# Altium schematic sheet 3. Buck Boost_19V.SchDoc
size A4; SheetNumber: 3; SheetTotal: 6; PageSetup: Record=PageOptions|CenterHorizontal=True|CenterVertical=True|PrintScale=1.00|XCorrection=1.00|YCorrection=1.00|PrintKind=0|BorderSize=5000000|LeftOffset=0|BottomOffset=0|Orientation=2|PaperLength=2970|PaperWidth=2100|Scale=100|PaperSource=7|PrintQuality=-3|MediaType=1|DitherType=10|PrintScaleMode=1|PaperKind=A4|PaperIndex=9
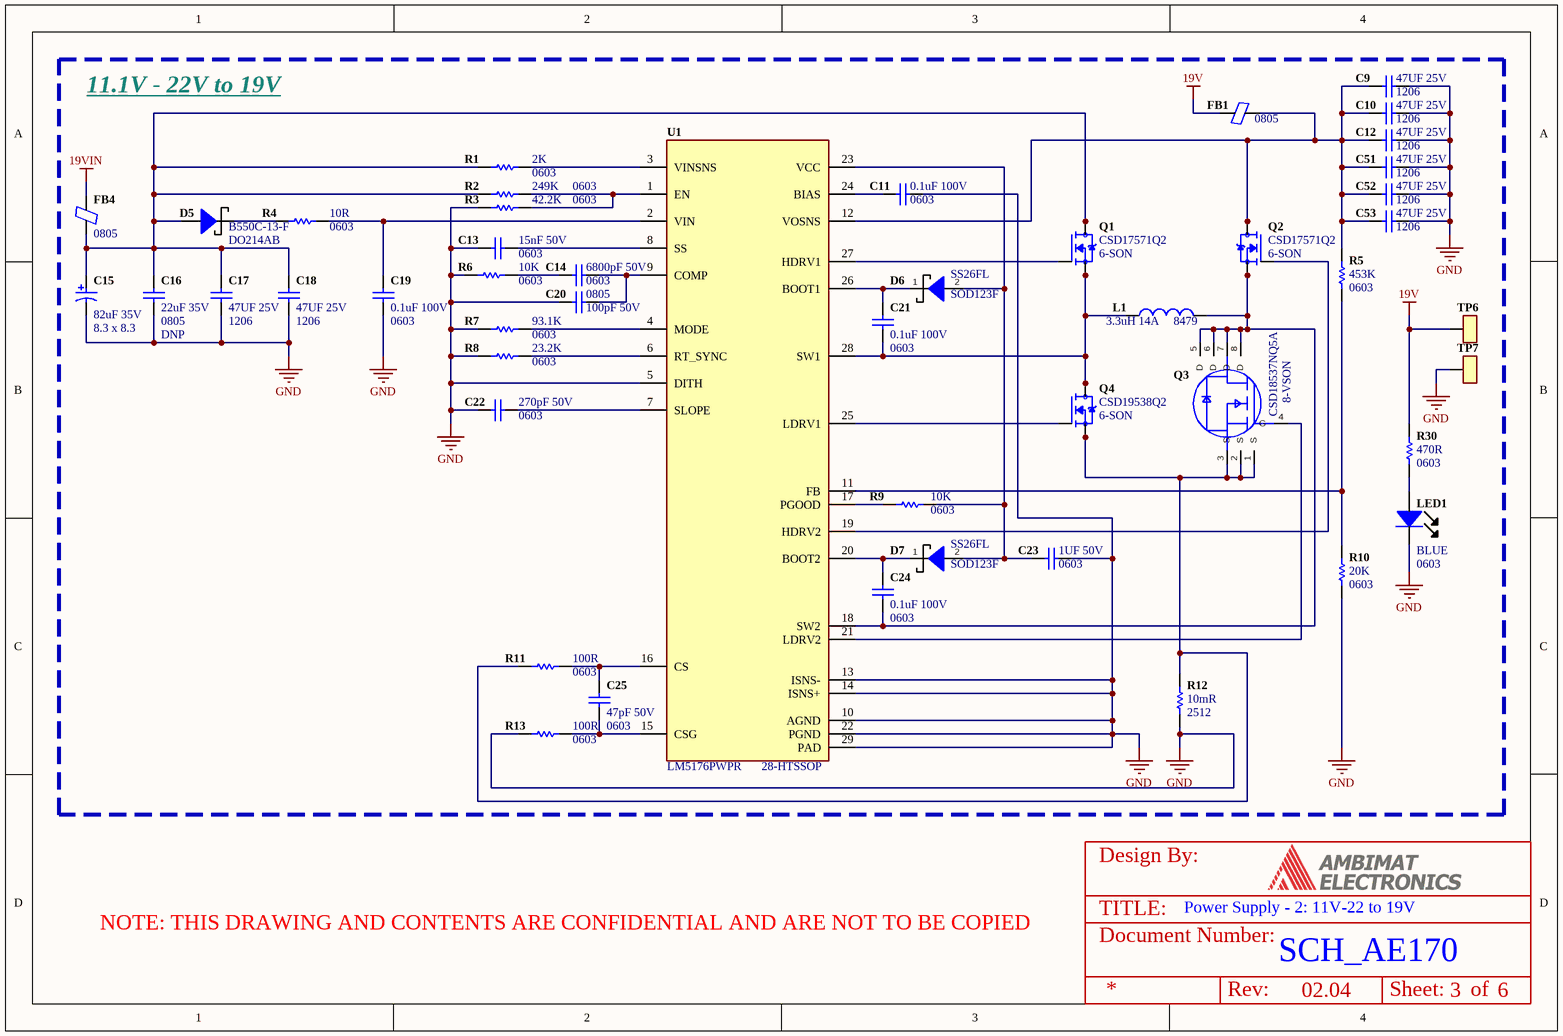
[diagram p0: 3. Buck Boost_19V.SchDoc]

## Parts
C9  Part Name: 47UF 25V  PCB Footprint: 1206  [1206 - NP]  (hidden comment: CAP CER 47UF 25V X5R 1206)
C10  Part Name: 47UF 25V  PCB Footprint: 1206  [1206 - NP]  (hidden comment: CAP CER 47UF 25V X5R 1206)
C11  Part Name: 0.1uF 100V  PCB Footprint: 0603  [0603C]  (hidden comment: CAP CER 0.1UF 100V X7R 0603)
C12  Part Name: 47UF 25V  PCB Footprint: 1206  [1206 - NP]  (hidden comment: CAP CER 47UF 25V X5R 1206)
C13  Part Name: 15nF 50V  PCB Footprint: 0603  [0603C]  (hidden comment: CAP CER 0.015UF 50V X7R 0603)
C14  Part Name: 6800pF 50V  PCB Footprint: 0603  [0603C]  (hidden comment: CAP CER 6800PF 50V X7R 0603)
C15  Part Name: 82uF 35V  PCB Footprint: 8.3 x 8.3  [CAP_PC_8X12_NCH]  (hidden comment: CAP ALUM POLY 82UF 20% 35V SMD)
C16  Mounting: DNP  Part Name: 22uF 35V  PCB Footprint: 0805  [0805C]  (hidden comment: CAP CER 22UF 35V X5R 0805)
C17  Part Name: 47UF 25V  PCB Footprint: 1206  [1206 - NP]  (hidden comment: CAP CER 47UF 25V X5R 1206)
C18  Part Name: 47UF 25V  PCB Footprint: 1206  [1206 - NP]  (hidden comment: CAP CER 47UF 25V X5R 1206)
C19  Part Name: 0.1uF 100V  PCB Footprint: 0603  [0603C]  (hidden comment: CAP CER 0.1UF 100V X7R 0603)
C20  Part Name: 100pF 50V  PCB Footprint: 0805  [0805C]  (hidden comment: CAP CER 100PF 50V C0G/NP0 0805)
C21  Part Name: 0.1uF 100V  PCB Footprint: 0603  [0603C]  (hidden comment: CAP CER 0.1UF 100V X7R 0603)
C22  Part Name: 270pF 50V  PCB Footprint: 0603  [0603C]  (hidden comment: CAP CER 270PF 50V X7R 0603)
C23  Part Name: 1UF 50V  PCB Footprint: 0603  [0603C]  (hidden comment: CAP CER 1UF 50V X7R 0603)
C24  Part Name: 0.1uF 100V  PCB Footprint: 0603  [0603C]  (hidden comment: CAP CER 0.1UF 100V X7R 0603)
C25  Part Name: 47pF 50V  PCB Footprint: 0603  [0603C]  (hidden comment: CAP CER 47PF 50V X7R 10% 0603)
C51  Part Name: 47UF 25V  PCB Footprint: 1206  [1206 - NP]  (hidden comment: CAP CER 47UF 25V X5R 1206)
C52  Part Name: 47UF 25V  PCB Footprint: 1206  [1206 - NP]  (hidden comment: CAP CER 47UF 25V X5R 1206)
C53  Part Name: 47UF 25V  PCB Footprint: 1206  [1206 - NP]  (hidden comment: CAP CER 47UF 25V X5R 1206)
D5  PCB Footprint: DO214AB  Part Name: B550C-13-F  [DO-214AB-SHKY]  (hidden comment: DIODE SCHOTTKY 50V 5A SMC)
D6  PCB Footprint: SOD123F  Part Name: SS26FL  [SOD123F-SHKY]  (hidden comment: DIODE SCHOTTKY 60V 2A SOD123F)
D7  PCB Footprint: SOD123F  Part Name: SS26FL  [SOD123F-SHKY]  (hidden comment: DIODE SCHOTTKY 60V 2A SOD123F)
FB1  PCB Footprint: 0805  [0805F]  (hidden comment: FERRITE BEAD 120 OHM 0805 1LN)
FB4  PCB Footprint: 0805  [0805F]  (hidden comment: FERRITE BEAD 120 OHM 0805 1LN)
L1  Part Name: 3.3uH 14A  PCB Footprint: 8479  [IND_8070-WE]  (hidden comment: FIXED IND 3.3UH 14A 8.2 MOHM SMD)
LED1  PCB Footprint: 0603  Color: BLUE  [LED0603_BLUE]  (hidden comment: LB Q39G-L2N2-35-1)
Q1  PCB Footprint: 6-SON  [CSD17571Q2]  (hidden comment: MOSFET N-CH 30V 22A 6SON)
Q2  PCB Footprint: 6-SON  [CSD17571Q2]  (hidden comment: MOSFET N-CH 30V 22A 6SON)
Q3  PCB Footprint: 8-VSON  Part Name: CSD18537NQ5A  [SON127P500X600]  (hidden comment: MOSFET N-CH 60V 50A 8VSON)
Q4  PCB Footprint: 6-SON  Part Name: CSD19538Q2  [CSD17571Q2]  (hidden comment: MOSFET N-CH 100V 14.4A 6WSON)
R1  Part Name: 2K  [0603]  (hidden comment: RS2K-0.1W0603)
R2  Part Name: 249K  [0603]  (hidden comment: RES SMD 249K OHM 1% 1/10W 0603)
R3  Part Name: 42.2K  [0603]  (hidden comment: RES 42.2K OHM 1% 1/10W 0603)
R4  Part Name: 10R  [0603]  (hidden comment: RES SMD 10 OHM 1% 1/10W 0603)
R5  Part Name: 453K  [0603]  (hidden comment: RES 453K OHM 1% 1/10W 0603)
R6  Part Name: 10K  [0603]  (hidden comment: RES SMD 10K OHM 5% 1/10W 0603)
R7  Part Name: 93.1K  [0603]  (hidden comment: RES 93.1K OHM 1% 1/10W 0603)
R8  Part Name: 23.2K  [0603]  (hidden comment: RES 23.2K OHM 1% 1/10W 0603)
R9  Part Name: 10K  [0603]  (hidden comment: RES SMD 10K OHM 5% 1/10W 0603)
R10  Part Name: 20K  [0603]  (hidden comment: RES SMD 20K OHM 5% 1/10W 0603)
R11  Part Name: 100R  [0603]  (hidden comment: RES SMD 100 OHM 1% 1/10W 0603)
R12  Part Name: 10mR  PCB Footprint: 2512  [R2512]  (hidden comment: RES 0.01 OHM 1% 3W 2512)
R13  Part Name: 100R  [0603]  (hidden comment: RES SMD 100 OHM 1% 1/10W 0603)
R30  Part Name: 470R  [0603]  (hidden comment: RES 470 OHM 1/10W 5% 0603 SMD)
TP6  TEST POINT  [TP-1.5mmSMD]  (value not drawn)
TP7  TEST POINT  [TP-1.5mmSMD]  (value not drawn)
U1  PCB Footprint: 28-HTSSOP  [HSSOP-28]  (hidden comment: LM5176PWPR)

## Blocks framed on the sheet
11.1V - 22V to 19V: C9-C25 C51-C53 D5-D7 FB1 FB4 L1 LED1 Q1-Q4 R1-R13 R30 TP6 TP7 U1

## Nets
19V: FB1.1 R30.2 TP6.1
19VIN: FB4.1
GND: C9.2 C10.2 C11.2 C12.2 C13.1 C15.2 C16.2 C17.1 C18.1 C19.2 C20.1 C22.1 C23.2 C51.2 C52.2 C53.2 LED1.2(K) R3.1 R6.1 R7.1 R8.1 R10.1 R12.1 R13.1 TP7.1 U1.5(DITH) U1.10(AGND) U1.13(ISNS-) U1.14(ISNS+) U1.22(PGND) U1.29(PAD)
NetC9_1: C9.1 C10.1 C12.1 C51.1 C52.1 C53.1 FB1.2 Q2.1(D) Q2.2(D) Q2.5(D) Q2.6(D) Q2.7(D) R5.2 U1.12(VOSNS)
NetC11_1: C11.1 U1.24(BIAS)
NetC13_2: C13.2 U1.8(SS)
NetC14_1: C14.1 R6.2
NetC14_2: C14.2 C20.2 U1.9(COMP)
NetC15_1: C15.1 C16.1 C17.2 C18.2 D5.2 FB4.2 Q1.1(D) Q1.2(D) Q1.5(D) Q1.6(D) Q1.7(D) R1.1 R2.1
NetC19_1: C19.1 R4.2 U1.2(VIN)
NetC21_1: C21.1 L1.1 Q1.4(S) Q1.8(S) Q4.1(D) Q4.2(D) Q4.5(D) Q4.6(D) Q4.7(D) U1.28(SW1)
NetC21_2: C21.2 D6.1 U1.26(BOOT1)
NetC22_2: C22.2 U1.7(SLOPE)
NetC23_1: C23.1 D6.2 D7.2 R9.2 U1.23(VCC)
NetC24_1: C24.1 L1.2 Q2.4(S) Q2.8(S) Q3.5(D) Q3.6(D) Q3.7(D) Q3.8(D) U1.18(SW2)
NetC24_2: C24.2 D7.1 U1.20(BOOT2)
NetC25_1: C25.1 R11.2 U1.16(CS)
NetC25_2: C25.2 R13.2 U1.15(CSG)
NetD5_1: D5.1 R4.1
NetLED1_1: LED1.1(A) R30.1
NetQ1_3: Q1.3(G) U1.27(HDRV1)
NetQ2_3: Q2.3(G) U1.19(HDRV2)
NetQ3_1: Q3.1(S) Q3.2(S) Q3.3(S) Q4.4(S) Q4.8(S) R11.1 R12.2
NetQ3_4: Q3.4(G) U1.21(LDRV2)
NetQ4_3: Q4.3(G) U1.25(LDRV1)
NetR1_2: R1.2 U1.3(VINSNS)
NetR2_2: R2.2 R3.2 U1.1(EN)
NetR5_1: R5.1 R10.2 U1.11(FB)
NetR7_2: R7.2 U1.4(MODE)
NetR8_2: R8.2 U1.6(RT_SYNC)
NetR9_1: R9.1 U1.17(PGOOD)

## Notes on the sheet
- Power Supply - 2: 11V-22 to 19V
- SCH_AE170
- 02.04
- TITLE:
- Design By:
- NOTE: THIS DRAWING AND CONTENTS ARE CONFIDENTIAL AND ARE NOT TO BE COPIED
- Document Number:
- Rev:
- Sheet:
- of

## Library data of the parts
C9 C10 C12 C17 C18 C51-C53 = CS47UF-25V1206: Manufacturer Part Number: C3216X5R1E476M160AC; Manufacturer: TDK Corporation; Vendor-1 Part Number: 445-8047-1-ND; Type: SMD; Vendor-1: DIGIKEY; Vendor-2: FARNELL; Lead Free: YES; Mounting: YES; RoHS Compliant: YES
C11 C19 C21 C24 = CS0.1uF-100V0603: Manu Part Number: CC0603KRX7R0BB104; Manufacturer: YAGEO; Vendor-1 Part Number: 311-1523-1-ND; Type: SMD; Vendor-1: DIGIKEY; Vendor-2: MOUSER; Lead Free: YES; Mounting: YES; RoHS Compliant: YES
C13 = CS15nF-50V0603: Manufacturer Part Number: CL10B153KB8NNNC; Manufacturer: Samsung Electro-Mechanics; Vendor-1 Part Number: 1276-1277-1-ND; Type: SMD; Vendor-1: DIGIKEY; Vendor-2: FARNELL; Lead Free: YES; Mounting: YES; RoHS Compliant: YES
C14 = CS6800pF-50V0603: Manufacturer: YAGEO; Vendor-1 Part Number: 13-AC0603KPX7R9BB682CT-ND; Manufacturer Part Number: AC0603KPX7R9BB682; Type: SMD; Vendor-1: DIgikey; Vendor-2: Element14; Lead Free: YES; Mounting: YES; Rohs Complinat: YES
C15 = CS82uF-35VALUM: Manu Part Number: 35SVPF82M; Manufacturer: Panasonic; Vendor-1 Part Number: P16562CT-ND; Vendor-1: DIGIKEY; Vendor-2: FARNELL; Help URL: *; Lead Free: YES; Mounting: YES; RoHS Compliant: YES; Type: SMD
C16 = CS22uF-35V0805: Manu Part Number: C2012X5R1V226M125AC; Manufacturer: TDK Corporation; Vendor-1 Part Number: 445-14428-1-ND; Type: SMD; Vendor-1: DIGIKEY; Vendor-2: FARNELL; Help URL: *; Lead Free: YES; RoHS Compliant: YES
C20 = CS100pF-50V0805: Manufacturer: AVX Corporation; Vendor-1 Part Number: 478-1316-1-ND; Manu Part Number: 08055A101JAT2A; Type: SMD; Vendor-1: DIGIKEY; Vendor-2: FARNELL; Lead Free: YES; Mounting: YES; Vendor-2 Part Number: *; HELP URL: https://www.digikey.in/products/en?keywords=478-1316-1-ND; RoHS Compliant: YES
C22 = CS270pF-50V0603: Manufacturer Part Number: CC0603KRX7R9BB271; Manufacturer: Yageo; Vendor-1 Part Number: 311-1185-1-ND; Type: SMD; Vendor-1: DIgikey; Vendor-2: Element14; Lead Free: YES; Rohs Complinat: YES; Mounting: YES
C23 = CS1uF-50V0603: Manu Part Number: CC0603KRX7R9BB105; Manufacturer: Yageo; Vendor-1 Part Number: 311-2082-1-ND; Type: SMD; Vendor-1: DIGIKEY; Vendor-2: FARNELL; Help URL: *; Lead Free: YES; Mounting: YES; RoHS Compliant: YES
C25 = CS47pF-50V0603: Manufacturer: KEMET; Vendor-1 Part Number: 399-16402-1-ND; Manufacturer Part Number: C0603C470K5RAC7867; Type: SMD; Vendor-1: DIGIKEY; Vendor-2: FARNELL; Lead Free: YES; Mounting: YES; RoHS Compliant: YES
D5 = DS-B550C-13-F: Manufacturer: Diodes Incorporated; Vendor-1 Part Number: B550C-FDICT-ND; Type: SMD; Vendor-1: DIGI-KEY; Vendor-2: MOUSER; Help URL: *; Lead Free: YES; Mounting: YES; Manu Part Number: B550C-13-F
D6 D7 = DS-SS26FL: Manufacturer: onsemi; Vendor-1 Part Number: SS26FLCT-ND; Type: SMD; Vendor-1: DIGI-KEY; Vendor-2: MOUSER; Help URL: *; Lead Free: YES; Mounting: YES; Manu Part Number: SS26FL
FB1 FB4 = FB120OHM-0805: Manufacturer: Pulse Electronics; Manufacturer Part Number: ABUP00201209121Y00; Vendor-1 Part Number: 553-ABUP00201209121Y00CT-ND; Vendor-1: Digikey; Type: SMD; Lead Free: YES; RoHS Compliant: YES; Vendor-2 Part Number: *; Vendor-2: *; Mounting: YES; Part Name: ABUP00201209121Y00
L1 = LS3.3uH14A-8479: Manufacturer Part Number: 7443340330; Manufacturer: Würth Elektronik; Vendor-1 Part Number: 732-2165-1-ND; Vendor-1: Digikey; Lead Free: YES; Type: SMD; RoHS Compliant: YES; Vendor-2 Part Number: *; Vendor-2: *; Mounting: YES
LED1 = LED-BLUE0603: LED BLUE CLEAR 3MM 470NM; Manufacturer: OSRAM Opto Semiconductors Inc; Vendor-1 Part Number: 475-2816-1-ND; Vendor-2 Part Number: 1652110; Type: SMD; Vendor-1: DIGIKEY; Vendor-2: FARNELL; Help URL: *; Lead Free: YES; Manu Part Number: LB Q39G-L2N2-35-1; Mounting: YES; RoHS Compliant: YES; Part Name: LB Q39G-L2N2-35-1
Q1 Q2 = MS-CSD17571Q2: Manufacturer: Texas Instruments; Vendor-1 Part Number: 296-37193-1-ND; Type: SMD; Vendor-1: DIGIKEY; Lead Free: YES; Manu Part Number: CSD17571Q2; Mounting: YES; RoHS Compliant: YES; Part Name: CSD17571Q2
Q3 = MS-CSD18537NQ5A: Manufacturer: Texas Instruments; Vendor-1 Part Number: 296-36455-1-ND; Type: TH; Vendor-1: DIGIKEY; Lead Free: YES; Manu Part Number: CSD18537NQ5A; Mounting: YES; RoHS Compliant: YES
Q4 = MS-CSD19538Q2: Manufacturer: Texas Instruments; Vendor-1 Part Number: 296-37193-1-ND; Type: SMD; Vendor-1: DIGIKEY; Lead Free: YES; Manu Part Number: CSD19538Q2; Mounting: YES; RoHS Compliant: YES
R1 = RS2K-0.1W0603: RES SMD 2K OHM 5% 1/10W 0603; Manu Part Number: ERJ-3GEYJ202V; Manufacturer: Panasonic; Vendor-1 Part Number: P2.0KGCT-ND; Vendor-1: DIGIKEY; Vendor-2: FARNELL; Lead Free: YES; Mounting: YES; RoHS Compliant: YES; Type: SMD; PCB Footprint: 0603
R2 = RS249K-0.1W0603: Manufacturer Part Number: AC0603FR-07249KL; Manufacturer: Yageo; Vendor-1 Part Number: 13-AC0603FR-07249KLCT-ND; Vendor-1: DIGIKEY; Vendor-2: FARNELL; Lead Free: YES; Mounting: YES; RoHS Compliant: YES; Type: SMD; PCB Footprint: 0603
R3 = RS42.2K-0.1W0603: Manufacturer Part Number: RC0603FR-0742K2L; Manufacturer: Yageo; Vendor-1 Part Number: 311-42.2KHRCT-ND; Vendor-1: DIGIKEY; Vendor-2: FARNELL; Lead Free: YES; Mounting: YES; RoHS Compliant: YES; Type: SMD; PCB Footprint: 0603
R4 = RS10R-0.1W0603: Manu Part Number: CRCW060310R0FKEA; Manufacturer: Vishay Dale; Vendor-1 Part Number: 541-10.0HCT-ND; Vendor-1: DIGIKEY; Vendor-2: FARNELL; Lead Free: YES; Mounting: YES; RoHS Compliant: YES; Type: SMD; PCB Footprint: 0603
R5 = RS453K-0.1W0603: Manu Part Number: RC0603FR-07453KL; Manufacturer: Yageo; Vendor-1 Part Number: 311-453KHRCT-ND; Vendor-1: DIGIKEY; Vendor-2: FARNELL; Lead Free: YES; Mounting: YES; RoHS Compliant: YES; Type: SMD; PCB Footprint: 0603
R6 = RS10K-0.1W0603: Manufacturer Part Number: RC0603JR-0710KL; Manufacturer: Yageo; Vendor-1 Part Number: 311-10KGRCT-ND; Vendor-1: DIGIKEY; Vendor-2: FARNELL; Lead Free: YES; Mounting: YES; Help URL: https://www.digikey.com/product-detail/en/yageo/RC0603JR-0710KL/311-10KGRCT-ND/729647; RoHS Compliant: YES; Type: SMD; PCB Footprint: 0603
R7 = RS93.1K-0.1W0603: Manu Part Number: RC0603FR-0793K1L; Manufacturer: YAGEO; Vendor-1 Part Number: 311-93.1KHRCT-ND; Vendor-1: DIGIKEY; Vendor-2: FARNELL; Lead Free: YES; Mounting: YES; RoHS Compliant: YES; Type: SMD; PCB Footprint: 0603
R8 = RS23.2K-0.1W0603: Manu Part Number: RC0603FR-0723K2L; Manufacturer: YAGEO; Vendor-1 Part Number: 311-23.2KHRCT-ND; Vendor-1: DIGIKEY; Vendor-2: FARNELL; Lead Free: YES; Mounting: YES; RoHS Compliant: YES; Type: SMD; PCB Footprint: 0603
R9 = RS10K-0.1W0603: Manufacturer: Yageo; Vendor-1 Part Number: 311-10KGRCT-ND; Manufacturer Part Number: RC0603JR-0710KL; Vendor-1: DIGIKEY; Vendor-2: FARNELL; Lead Free: YES; Mounting: YES; RoHS Compliant: YES; Type: SMD; PCB Footprint: 0603; Help URL: https://www.digikey.com/product-detail/en/yageo/RC0603JR-0710KL/311-10KGRCT-ND/729647
R10 = RS20K-0.1W0603: Manu Part Number: CRCW060320K0JNEA; Manufacturer: Vishay Dale; Vendor-1 Part Number: 541-20KGCT-ND; Vendor-1: DIGIKEY; Vendor-2: FARNELL; Lead Free: YES; Mounting: YES; RoHS Compliant: YES; Type: SMD; Help URL: *; PCB Footprint: 0603
R11 R13 = RS100R-0.1W0603: Manu Part Number: CRCW0603100RFKEA; Manufacturer: Vishay Dale; Vendor-1 Part Number: 541-100HCT-ND; Vendor-1: DIGIKEY; Vendor-2: FARNELL; Lead Free: YES; Mounting: YES; RoHS Compliant: YES; Type: SMD; PCB Footprint: 0603
R12 = RS10mR-3W2512: Manu Part Number: PA2512FKE7T0R01E; Manufacturer: YAGEO; Vendor-1 Part Number: 13-PA2512FKE7T0R01ECT-ND; Vendor-1: DIGIKEY; Vendor-2: FARNELL; Lead Free: YES; Mounting: YES; RoHS Compliant: YES; Type: SMD
R30 = RS470R-1/10W0603: Manu Part Number: RC0603JR-07470RL; Manufacturer: YAGEO; Vendor-1 Part Number: 311-470GRCT-ND; Vendor-1: DIGIKEY; Vendor-2: MOUSER; Lead Free: YES; Mounting: YES; RoHS Compliant: YES; Type: SMD; PCB Footprint: 0603
TP6 TP7 = TP-1.5mmSMD: SMD TEST POINT
U1 = IC28P-LM5176PWPR: Manufacturer: Texas Instruments; Vendor-1 Part Number: 296-49223-1-ND; Vendor-1: DigiKey; Vendor-2: Element14; Lead Free: YES; Mounting: YES; RoHS Compliant: YES; Type: SMD; Manufacturer Part Numbe: LM5176PWPR